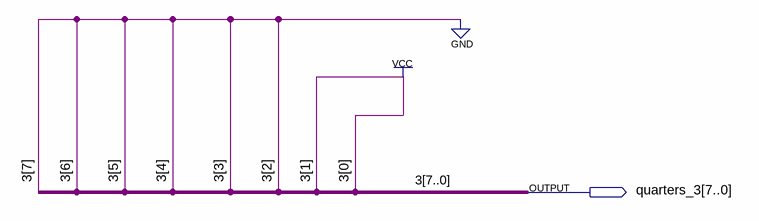
[diagram p0: schematic sheet]
// Quartus schematic quarters_3.bdf as structural Verilog: 0 symbols, 1 pins
module quarters_3 (
  output [7:0] quarters_3
);


  assign quarters_3 = 8'b00000011;
endmodule
